# Altium schematic sheet connectors.SchDoc
size 431 x 279 mm; SheetNumber: 1; SheetTotal: 1
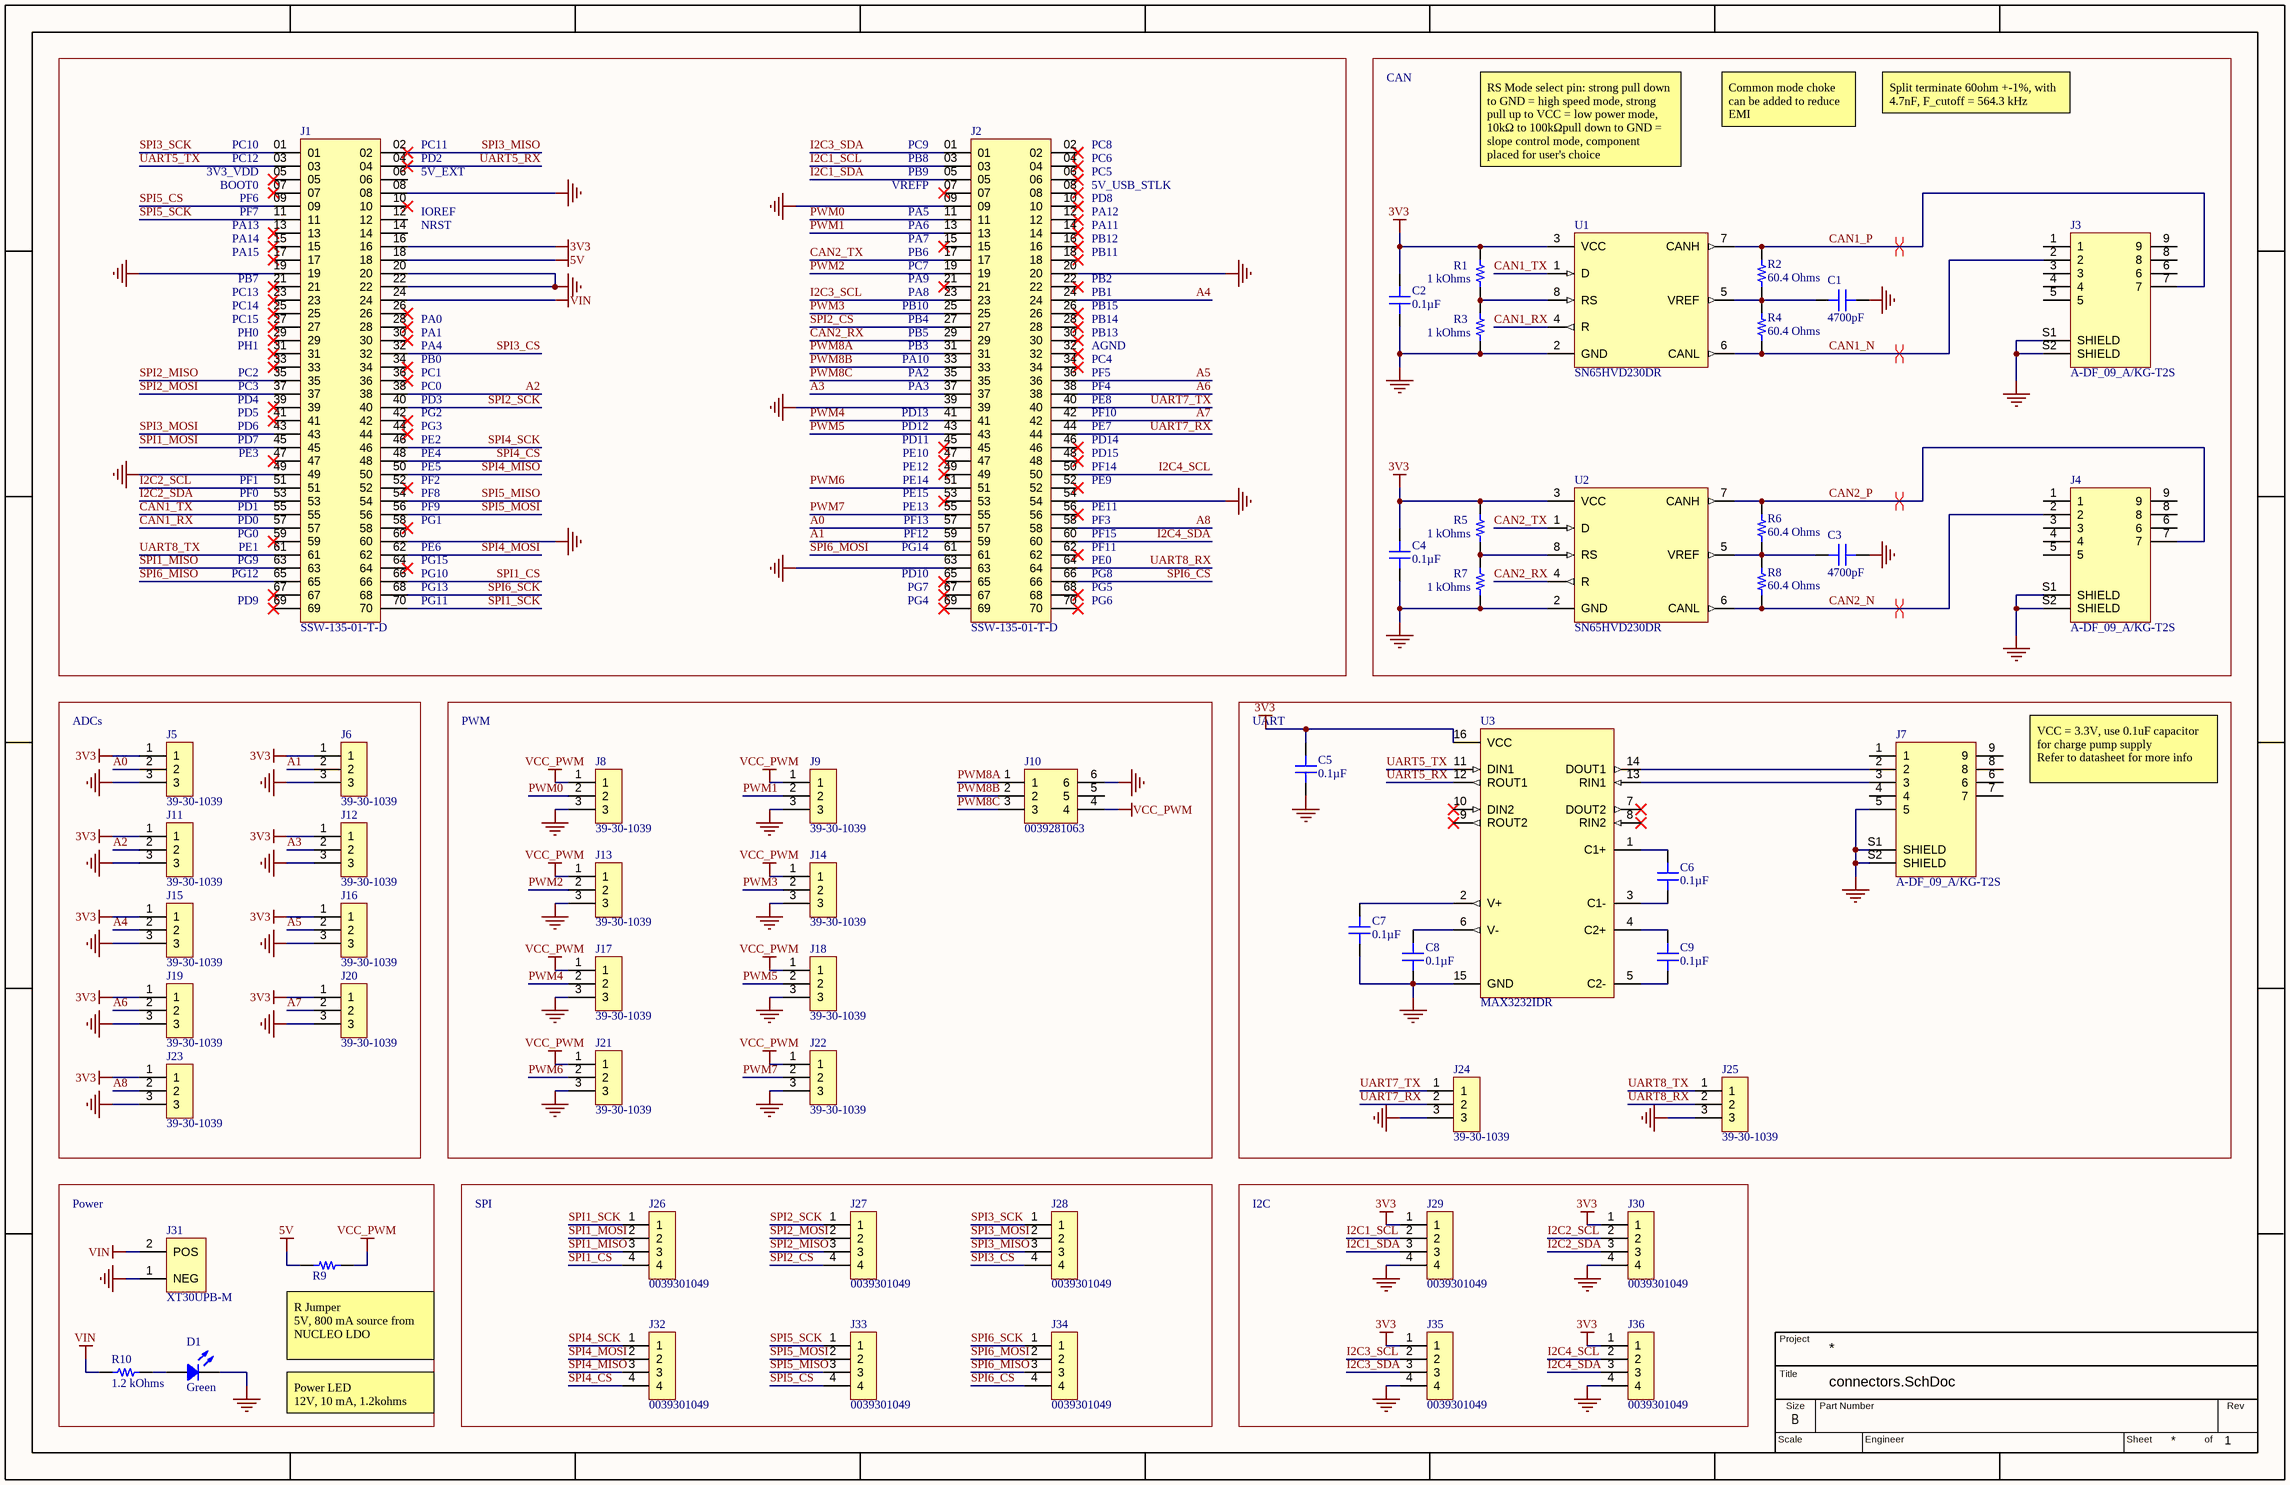
[diagram p0: connectors.SchDoc]

## Parts
C1  4700pF  [CAP 0603_1608]
C2  0.1µF  [CAP 0603_1608]
C3  4700pF  [CAP 0603_1608]
C4  0.1µF  [CAP 0603_1608]
C5  0.1µF  [CAP 0603_1608]
C6  0.1µF  [CAP 0603_1608]
C7  0.1µF  [CAP 0603_1608]
C8  0.1µF  [CAP 0603_1608]
C9  0.1µF  [CAP 0603_1608]
D1  Green  [LED 0805_2012 GREEN]
J1  SSW-135-01-T-D  [SAMTEC_SSW-135-01-T-D]
J2  SSW-135-01-T-D  [SAMTEC_SSW-135-01-T-D]
J3  A-DF_09_A/KG-T2S  [ASSMANN_A-DF09A/KG-T2S]
J4  A-DF_09_A/KG-T2S  [ASSMANN_A-DF09A/KG-T2S]
J5  39-30-1039  [MOLEX_39-30-1039]
J6  39-30-1039  [MOLEX_39-30-1039]
J7  A-DF_09_A/KG-T2S  [ASSMANN_A-DF09A/KG-T2S]
J8  39-30-1039  [MOLEX_39-30-1039]
J9  39-30-1039  [MOLEX_39-30-1039]
J10  0039281063  [MOLEX_0039281063]
J11  39-30-1039  [MOLEX_39-30-1039]
J12  39-30-1039  [MOLEX_39-30-1039]
J13  39-30-1039  [MOLEX_39-30-1039]
J14  39-30-1039  [MOLEX_39-30-1039]
J15  39-30-1039  [MOLEX_39-30-1039]
J16  39-30-1039  [MOLEX_39-30-1039]
J17  39-30-1039  [MOLEX_39-30-1039]
J18  39-30-1039  [MOLEX_39-30-1039]
J19  39-30-1039  [MOLEX_39-30-1039]
J20  39-30-1039  [MOLEX_39-30-1039]
J21  39-30-1039  [MOLEX_39-30-1039]
J22  39-30-1039  [MOLEX_39-30-1039]
J23  39-30-1039  [MOLEX_39-30-1039]
J24  39-30-1039  [MOLEX_39-30-1039]
J25  39-30-1039  [MOLEX_39-30-1039]
J26  0039301049  [MOLEX_0039301049]
J27  0039301049  [MOLEX_0039301049]
J28  0039301049  [MOLEX_0039301049]
J29  0039301049  [MOLEX_0039301049]
J30  0039301049  [MOLEX_0039301049]
J31  XT30UPB-M  [AMASS_XT30-M]
J32  0039301049  [MOLEX_0039301049]
J33  0039301049  [MOLEX_0039301049]
J34  0039301049  [MOLEX_0039301049]
J35  0039301049  [MOLEX_0039301049]
J36  0039301049  [MOLEX_0039301049]
R1  1 kOhms  [RES 0805_2012]
R2  60.4 Ohms  [RES 0603_1608]
R3  1 kOhms  [RES 0805_2012]
R4  60.4 Ohms  [RES 0603_1608]
R5  1 kOhms  [RES 0805_2012]
R6  60.4 Ohms  [RES 0603_1608]
R7  1 kOhms  [RES 0805_2012]
R8  60.4 Ohms  [RES 0603_1608]
R9  (no value)  [RES 0603_1608]
R10  1.2 kOhms  [RES 0603_1608]
U1  SN65HVD230DR  [SOIC127P599X175-8N]
U2  SN65HVD230DR  [SOIC127P599X175-8N]
U3  MAX3232IDR  [SOIC127P600X175-16N]

## Blocks framed on the sheet
CAN: C1-C4 J3 J4 R1-R8 U1 U2
ADCs: J5 J6 J11 J12 J15 J16 J19 J20 J23
PWM: J8-J10 J13 J14 J17 J18 J21 J22
UART: C5-C9 J7 J24 J25 U3
Power: D1 J31 R9 R10
SPI: J26-J28 J32-J34
I2C: J29 J30 J35 J36

## Nets
3V3: C2.2 C4.2 C5.2 J1.16 J5.1 J6.1 J11.1 J12.1 J15.1 J16.1 J19.1 J20.1 J23.1 J29.1 J30.1 J35.1 J36.1 R1.2 R5.2 U1.3(VCC) U2.3(VCC) U3.16(VCC)
5V: J1.18 R9.1
GND: C1.2 C2.1 C3.2 C4.1 C5.1 C7.1 C8.1 D1.2 J1.08 J1.19 J1.20 J1.22 J1.49 J1.60 J2.09 J2.20 J2.39 J2.54 J2.63 J3.S1(SHIELD) J3.S2(SHIELD) J4.S1(SHIELD) J4.S2(SHIELD) J5.3 J6.3 J7.5 J7.S1(SHIELD) J7.S2(SHIELD) J8.3 J9.3 J10.6 J11.3 J12.3 J13.3 J14.3 J15.3 J16.3 J17.3 J18.3 J19.3 J20.3 J21.3 J22.3 J23.3 J24.3 J25.3 J29.4 J30.4 J31.1(NEG) J35.4 J36.4 R3.1 R7.1 U1.2(GND) U2.2(GND) U3.15(GND)
VCC_PWM: J8.1 J9.1 J10.4 J13.1 J14.1 J17.1 J18.1 J21.1 J22.1 R9.2
VIN: J1.24 J31.2(POS) R10.1
A0: J2.57 J5.2
A1: J2.59 J6.2
A2: J1.38 J11.2
A3: J2.37 J12.2
A4: J2.24 J15.2
A5: J2.36 J16.2
A6: J2.38 J19.2
A7: J2.42 J20.2
A8: J2.58 J23.2
CAN1_N: J3.2 R4.2 U1.6(CANL)
CAN1_P: J3.7 R2.1 U1.7(CANH)
CAN1_RX: J1.57 U1.4(R)
CAN1_TX: J1.55 U1.1(D)
CAN2_N: J4.2 R8.2 U2.6(CANL)
CAN2_P: J4.7 R6.1 U2.7(CANH)
CAN2_RX: J2.29 U2.4(R)
CAN2_TX: J2.17 U2.1(D)
I2C1_SCL: J2.03 J29.2
I2C1_SDA: J2.05 J29.3
I2C2_SCL: J1.51 J30.2
I2C2_SDA: J1.53 J30.3
I2C3_SCL: J2.23 J35.2
I2C3_SDA: J2.01 J35.3
I2C4_SCL: J2.50 J36.2
I2C4_SDA: J2.60 J36.3
PWM0: J2.11 J8.2
PWM1: J2.13 J9.2
PWM2: J2.19 J13.2
PWM3: J2.25 J14.2
PWM4: J2.41 J17.2
PWM5: J2.43 J18.2
PWM6: J2.51 J21.2
PWM7: J2.55 J22.2
PWM8A: J2.31 J10.1
PWM8B: J2.33 J10.2
PWM8C: J2.35 J10.3
SPI1_CS: J1.66 J26.4
SPI1_MISO: J1.63 J26.3
SPI1_MOSI: J1.45 J26.2
SPI1_SCK: J1.70 J26.1
SPI2_CS: J2.27 J27.4
SPI2_MISO: J1.35 J27.3
SPI2_MOSI: J1.37 J27.2
SPI2_SCK: J1.40 J27.1
SPI3_CS: J1.32 J28.4
SPI3_MISO: J1.02 J28.3
SPI3_MOSI: J1.43 J28.2
SPI3_SCK: J1.01 J28.1
SPI4_CS: J1.48 J32.4
SPI4_MISO: J1.50 J32.3
SPI4_MOSI: J1.62 J32.2
SPI4_SCK: J1.46 J32.1
SPI5_CS: J1.09 J33.4
SPI5_MISO: J1.54 J33.3
SPI5_MOSI: J1.56 J33.2
SPI5_SCK: J1.11 J33.1
SPI6_CS: J2.66 J34.4
SPI6_MISO: J1.65 J34.3
SPI6_MOSI: J2.61 J34.2
SPI6_SCK: J1.68 J34.1
UART5_RX: J1.04 U3.12(ROUT1)
UART5_TX: J1.03 U3.11(DIN1)
UART7_RX: J2.44 J24.2
UART7_TX: J2.40 J24.1
UART8_RX: J2.64 J25.2
UART8_TX: J1.61 J25.1
NetC1_1: C1.1 R2.2 R4.1 U1.5(VREF)
NetC3_1: C3.1 R6.2 R8.1 U2.5(VREF)
NetC6_1: C6.1 U3.3(C1-)
NetC6_2: C6.2 U3.1(C1+)
NetC7_2: C7.2 U3.2(V+)
NetC8_2: C8.2 U3.6(V-)
NetC9_1: C9.1 U3.5(C2-)
NetC9_2: C9.2 U3.4(C2+)
NetD1_1: D1.1 R10.2
NetJ7_2: J7.2 U3.14(DOUT1)
NetJ7_3: J7.3 U3.13(RIN1)
NetR1_1: R1.1 R3.2 U1.8(RS)
NetR5_1: R5.1 R7.2 U2.8(RS)

Not connected (* = marked no-connect by the designer): J1 05* 06 07* 10* 12 13* 14 15* 17* 21* 23* 25* 26* 27* 28* 29* 30* 31* 33* 34* 36* 39* 41* 42* 44* 47* 52* 58* 59* 64* 67* 69*; J2 02* 04* 06* 07* 08* 10* 12* 14* 15* 16* 18* 21* 22* 26* 28* 30* 32* 34* 45* 46* 47* 48* 49* 52* 53* 56* 62* 65* 67* 68* 69* 70*; J3 1 3 4 5 6 8 9; J4 1 3 4 5 6 8 9; J7 1 4 6 7 8 9; J10 5; U3 7(DOUT2)* 8(RIN2)* 9(ROUT2)* 10(DIN2)*

## Layout directives
differential pair: CAN1_N, CAN1_P, CAN2_N, CAN2_P

## Notes on the sheet
- (near J1) PC12
- (near J1) PC10
- (near J1) PD2
- (near J1) PC11
- (near J2) PC9
- (near J2) PB8
- (near J2) PC8
- (near J2) PC6
- RS Mode select pin: strong pull down to GND = high speed mode, strong
  pull up to VCC = low power mode, 10kΩ to 100kΩpull down to GND = slope control mode, component placed for user's choice
- Common mode choke can be added to reduce EMI
- Split terminate 60ohm +-1%, with 4.7nF, F_cutoff = 564.3 kHz
- (near J1) BOOT0
- (near J1) PF6
- (near J1) PF7
- (near J1) PA13
- (near J1) 3V3_VDD
- (near J1) 5V_EXT
- (near J1) IOREF
- (near J1) NRST
- (near J2) PA5
- (near J2) PA6
- (near J2) PB9
- (near J2) VREFP
- (near J2) PC5
- (near J2) PD8
- (near J2) PA12
- (near J2) PA11
- (near J2) 5V_USB_STLK
- (near J1) PB7
- (near J1) PA15
- (near J1) PA14
- (near J1) PC13
- (near J2) PC7
- (near J2) PA8
- (near J2) PB6
- (near J2) PA7
- (near J2) PA9
- (near J2) PB1
- (near J2) PB12
- (near J2) PB11
- (near J2) PB2
- (near J1) PC14
- (near J1) PC15
- (near J1) PH0
- (near J1) PH1
- (near J1) PA0
- (near J1) PA1
- (near J1) PA4
- (near J1) PB0
- (near J2) PB10
- (near J2) PB3
- (near J2) PA10
- (near J2) PB4
- (near J2) PB5
- (near J2) PB15
- (near J2) PB14
- (near J2) PB13
- (near J2) PC4
- (near J2) AGND
- (near J1) PC3
- (near J1) PC2
- (near J1) PD6
- (near J1) PD4
- (near J1) PD5
- (near J1) PC0
- (near J1) PD3
- (near J1) PC1
- (near J1) PG2
- (near J1) PG3
- (near J2) PA2
- (near J2) PA3
- (near J2) PD13
- (near J2) PD12
- (near J2) PF5
- (near J2) PF10
- (near J2) PF4
- (near J2) PE8
- (near J2) PE7
- (near J1) PD7
- (near J1) PF1
- (near J1) PF0
- (near J1) PE3
- (near J1) PF8
- (near J1) PE2
- (near J1) PE4
- (near J1) PE5
- (near J1) PF2
- (near J2) PD11
- (near J2) PE10
- (near J2) PE12
- (near J2) PE14
- (near J2) PE15
- (near J2) PF14
- (near J2) PD14
- (near J2) PD15
- (near J2) PE9
- (near J1) PD0
- (near J1) PD1
- (near J1) PE1
- (near J1) PG9
- (near J1) PG0
- (near J1) PF9
- (near J1) PE6
- (near J1) PG1
- (near J1) PG15
- (near J2) PG14
- (near J2) PF13
- (near J2) PF12
- (near J2) PE13
- (near J2) PF3
- (near J2) PE0
- (near J2) PF15
- (near J2) PE11
- (near J2) PF11
- (near J1) PG12
- (near J1) PD9
- (near J1) PG13
- (near J1) PG10
- (near J1) PG11
- (near J2) PD10
- (near J2) PG7
- (near J2) PG4
- (near J2) PG8
- (near J2) PG5
- (near J2) PG6
- VCC = 3.3V, use 0.1uF capacitor for charge pump supply
  Refer to datasheet for more info
- (near R9) R Jumper
  5V, 800 mA source from NUCLEO LDO
- Power LED
  12V, 10 mA, 1.2kohms
- Title
- Project
- Scale
- Size
- B
- Part Number
- Engineer
- Sheet
- of
- Rev

## Library data of the parts
C1 C3 = CGA3E2X7R1H472K080AA: CAP CER 4700PF 50V X7R 0603; Manufacturer: TDK Corporation; Tolerance: ±10%; Part Number: CGA3E2X7R1H472K080AA; Value: 4700pF; Applications: Automotive; Capacitance: 4700pF; ComponentLink1Description: Datasheet; ComponentLink1URL: https://product.tdk.com/info/en/catalog/datasheets/mlcc_automotive_general_en.pdf?ref_disty=digikey; ComponentLink2Description: DigiKey Link; ComponentLink2URL: http://digikey.com/product-detail/en/tdk-corporation/CGA3E2X7R1H472K080AA/445-5661-1-ND/2443701; Device Package: 0603 (1608 Metric); LastUpdated: 9/2/2020 1:03:30 AM; Lifecycle Status: Active; Minimum Order: 1; Mounting Type: Surface Mount, MLCC; Operating Temperature: -55°C ~ 125°C; Package / Case: 0603 (1608 Metric); Packaging: TapeAndReel; PartId: 5842; Part Status: Active; Price: 0.01; Ratings: AEC-Q200; Series: CGA; Size / Dimension: 0.063" L x 0.031" W (1.60mm x 0.80mm); Supplier 1: DigiKey; Supplier Part Number 1: 445-5661-1-ND; Temperature Coefficient: X7R; Thickness (Max): 0.035" (0.90mm); Voltage - Rated: 50V
C2 C4-C9 = CL10B104KA8NNNC: CAP CER 0.1UF 25V X7R 0603; Manufacturer: Samsung Electro-Mechanics; Tolerance: ±10%; Part Number: CL10B104KA8NNNC; Value: 0.1µF; Applications: General Purpose; Capacitance: 0.1µF; ComponentLink1Description: Datasheet; ComponentLink1URL: http://www.samsungsem.com/kr/support/product-search/mlcc/CL10B104KA8NNNC.jsp; ComponentLink2Description: DigiKey Link; ComponentLink2URL: http://digikey.com/product-detail/en/samsung-electro-mechanics/CL10B104KA8NNNC/1276-1006-1-ND/3889092; Device Package: 0603 (1608 Metric); LastUpdated: 9/2/2020 1:03:22 AM; Lifecycle Status: Active; Minimum Order: 1; Mounting Type: Surface Mount, MLCC; Operating Temperature: -55°C ~ 125°C; Package / Case: 0603 (1608 Metric); Packaging: TapeAndReel; PartId: 9793; Part Status: Active; Price: 0.01; Series: CL; Size / Dimension: 0.063" L x 0.031" W (1.60mm x 0.80mm); Supplier 1: DigiKey; Supplier Part Number 1: 1276-1006-1-ND; Temperature Coefficient: X7R; Thickness (Max): 0.035" (0.90mm); Voltage - Rated: 25V
D1 = LTST-C170GKT: LED GREEN CLEAR SMD; Manufacturer: Lite-On Inc.; Configuration: Standard; Current - Test: 10mA; Lens Color: Colorless; Lens Size: 1.40mm x 1.25mm; Lens Style: Rectangle with Flat Top; Millicandela Rating: 6mcd; Viewing Angle: 130°; Voltage - Forward (Vf) (Typ): 2.1V; Wavelength - Dominant: 569nm; Wavelength - Peak: 565nm; Part Number: LTST-C170GKT; Color: Green; ComponentLink1Description: Datasheet; ComponentLink1URL: //media.digikey.com/pdf/Data%20Sheets/Lite-On%20PDFs/LTST-C170GKT.pdf; ComponentLink2Description: DigiKey Link; ComponentLink2URL: http://digikey.com/product-detail/en/lite-on-inc/LTST-C170GKT/160-1179-1-ND/269251; Device Package: 0805 (2012 Metric); Height (Max): 1.10mm; LastUpdated: 9/2/2020 1:21:04 AM; Lens Transparency: Clear; Lifecycle Status: Active; Minimum Order: 1; Mounting Type: Surface Mount; Package / Case: 0805 (2012 Metric); Packaging: TapeAndReel; PartId: 282; Part Status: Active; Price: 0.05; Series: -; Size / Dimension: 2.00mm L x 1.25mm W; Supplier 1: DigiKey; Supplier Part Number 1: 160-1179-1-ND; Value: Green
J1 J2 = SSW-135-01-T-D: MF: Samtec; Value: *; Price: None; Package: None; Availability: Unavailable; MP: SSW-135-01-T-D
J3 J4 J7 = A-DF_09_A/KG-T2S: 9 Position D-Sub Receptacle, Female Sockets Connector; MP: A-DF 09 A/KG-T2S; MF: Assmann WSW; SnapEDA_Link: https://www.snapeda.com/parts/A-DF%2009%20A/KG-T2S/Assmann%20WSW%20Components/view-part/2761262/?ref=snap; Availability: Unavailable; Check_prices: https://www.snapeda.com/parts/A-DF%2009%20A/KG-T2S/Assmann%20WSW%20Components/view-part/2761262/?ref=eda; Price: None; Value: *; Package: None
J5 J6 J8 J9 J11-J25 = 39-30-1039: Connector Header Through Hole 3 position 0.165 _4.20mm_; MP: 39301039; MF: Molex; Price: None; Value: *; Package: None; SnapEDA_Link: https://www.snapeda.com/parts/39301039/Molex/view-part/1160208/?ref=snap; Availability: Unavailable
J10 = 0039281063: Connector Header Through Hole, 6 position 0.165 (4.20mm); MP: 0026013115; MF: Molex; Package: None; DigiKey-Purchase-URL: https://snapeda.com/shop?store=DigiKey&id=2597941; Value: *; SnapEDA_Link: https://www.snapeda.com/parts/0026013115/Molex/view-part/2597941/?ref=snap; Price: None; Availability: Unavailable
J26-J30 J32-J36 = 0039301049: Connector Header Through Hole 4 position 0.165 _4.20mm_; MF: Molex; Value: *; Package: None; Price: None; SnapEDA_Link: https://www.snapeda.com/parts/0039301049/Molex/view-part/104320/?ref=snap; Availability: Unavailable; MP: 0039301049
J31 = XT30UPB-M: Plug; DC supply; XT60; male; PIN: 2; for cable; soldered; 30A; 500V; MP: XT60-M; MF: AMASS; Price: None; Package: Package Analog Devices; Value: *; Availability: Unavailable; SnapEDA_Link: https://www.snapeda.com/parts/XT60-M/AMASS/view-part/2883912/?ref=snap
R1 R3 R5 R7 = RNCP0805FTD1K00: RES 1K OHM 1% 1/4W 0805; Manufacturer: Stackpole Electronics Inc; Power (Watts): 0.25W, 1/4W; Temperature Coefficient: ±100ppm/°C; Part Number: RNCP0805FTD1K00; Value: 1 kOhms; ComponentLink1Description: Datasheet; ComponentLink1URL: https://www.seielect.com/catalog/sei-rncp.pdf; ComponentLink2Description: DigiKey Link; ComponentLink2URL: http://digikey.com/product-detail/en/stackpole-electronics-inc/RNCP0805FTD1K00/RNCP0805FTD1K00CT-ND/2240568; Composition: Thin Film; Device Package: 0805 (2012 Metric); Features: Anti-Sulfur, Moisture Resistant; Height - Seated (Max): 0.024" (0.60mm); LastUpdated: 9/2/2020 1:15:23 AM; Lifecycle Status: Active; Minimum Order: 1; Number of Terminations: 2; Operating Temperature: -55°C ~ 155°C; Package / Case: 0805 (2012 Metric); Packaging: TapeAndReel; PartId: 28023; Part Status: Active; Price: 0.01; Resistance: 1 kOhms; Series: RNCP; Size / Dimension: 0.079" L x 0.049" W (2.00mm x 1.25mm); Supplier 1: DigiKey; Supplier Part Number 1: RNCP0805FTD1K00CT-ND; Supplier Device Package: 0805; Tolerance: ±1%
R2 R4 R6 R8 = RMCF0603FT60R4: RES 60.4 OHM 1% 1/10W 0603; Manufacturer: Stackpole Electronics Inc; Power (Watts): 0.1W, 1/10W; Temperature Coefficient: ±100ppm/°C; Part Number: RMCF0603FT60R4; Value: 60.4 Ohms; ComponentLink1Description: Datasheet; ComponentLink1URL: https://www.seielect.com/catalog/sei-rmcf_rmcp.pdf; ComponentLink2Description: DigiKey Link; ComponentLink2URL: http://digikey.com/product-detail/en/stackpole-electronics-inc/RMCF0603FT60R4/RMCF0603FT60R4CT-ND/2418105; Composition: Thick Film; Device Package: 0603 (1608 Metric); Features: Automotive AEC-Q200; Height - Seated (Max): 0.022" (0.55mm); LastUpdated: 9/2/2020 1:10:13 AM; Lifecycle Status: Active; Minimum Order: 1; Number of Terminations: 2; Operating Temperature: -55°C ~ 155°C; Package / Case: 0603 (1608 Metric); Packaging: CutTape; PartId: 10803; Part Status: Active; Price: 0.10; Ratings: AEC-Q200; Resistance: 60.4 Ohms; Series: RMCF; Size / Dimension: 0.061" L x 0.031" W (1.55mm x 0.80mm); Supplier 1: DigiKey; Supplier Part Number 1: RMCF0603FT60R4CT-ND; Supplier Device Package: 0603; Tolerance: ±1%
R9 = CRCW06030000Z0EBC: RES SMD 0 OHM JUMP 1/10W 0603; Manufacturer: Vishay Dale; Power (Watts): 0.1W, 1/10W; Tolerance: Jumper; Part Number: CRCW06030000Z0EBC; ComponentLink1Description: Datasheet; ComponentLink1URL: http://www.vishay.com/docs/28773/crcwce3.pdf; ComponentLink2Description: DigiKey Link; ComponentLink2URL: http://digikey.com/product-detail/en/vishay-dale/CRCW06030000Z0EBC/541-4013-1-ND/7928696; Composition: Thick Film; Device Package: 0603 (1608 Metric); Height - Seated (Max): 0.022" (0.55mm); LastUpdated: 9/2/2020 1:10:22 AM; Lifecycle Status: Active; Minimum Order: 1; Number of Terminations: 2; Operating Temperature: -55°C ~ 155°C; Package / Case: 0603 (1608 Metric); Packaging: CutTape; PartId: 6257; Part Status: Active; Price: 0.10; Series: CRCW-C; Supplier 1: DigiKey; Supplier Part Number 1: 541-4013-1-ND; Supplier Device Package: 0603
R10 = CRGCQ0603F1K2: CRGCQ 0603 1K2 1%; Manufacturer: TE Connectivity Passive Product; Power (Watts): 0.1W, 1/10W; Temperature Coefficient: ±100ppm/°C; Part Number: CRGCQ0603F1K2; Value: 1.2 kOhms; ComponentLink1Description: Datasheet; ComponentLink1URL: https://www.te.com/commerce/DocumentDelivery/DDEController?Action=srchrtrv&DocNm=1773204-3&DocType=DS&DocLang=English; ComponentLink2Description: DigiKey Link; ComponentLink2URL: http://digikey.com/product-detail/en/te-connectivity-passive-product/CRGCQ0603F1K2/A129689CT-ND/8577521; Composition: Thick Film; Device Package: 0603 (1608 Metric); Features: Automotive AEC-Q200, Moisture Resistant; Height - Seated (Max): 0.022" (0.55mm); LastUpdated: 9/2/2020 1:09:39 AM; Lifecycle Status: Active; Minimum Order: 1; Number of Terminations: 2; Operating Temperature: -55°C ~ 155°C; Package / Case: 0603 (1608 Metric); Packaging: CutTape; PartId: 23998; Part Status: Active; Price: 0.10; Ratings: AEC-Q200; Resistance: 1.2 kOhms; Series: CRGCQ; Size / Dimension: 0.063" L x 0.031" W (1.60mm x 0.80mm); Supplier 1: DigiKey; Supplier Part Number 1: A129689CT-ND; Supplier Device Package: 0603; Tolerance: ±1%
U1 U2 = SN65HVD230DR: 3.3 V CAN Transceiver with Standby Mode 8-SOIC -40 to 85; MF: Texas Instruments; Package: SOIC-8 Texas Instruments; DigiKey-Purchase-URL: https://snapeda.com/shop?store=DigiKey&id=51767; MP: SN65HVD230DR; Mouser-Purchase-URL: https://snapeda.com/shop?store=Mouser&id=51767; Value: *; Arrow_Electronics-Purchase-URL: https://snapeda.com/shop?store=Arrow+Electronics&id=51767; Availability: Good; SnapEDA_Link: https://www.snapeda.com/parts/SN65HVD230DR/Texas%20Instruments/view-part/51767/?ref=snap; Price: None; Texas_Instruments-Purchase-URL: https://snapeda.com/shop?store=Texas+Instruments&id=51767
U3 = MAX3232IDR: 3-V to 5.5-V multichannel RS-232 line driver & receiver 16-SOIC -40 to 85; MF: Texas Instruments; Check_prices: https://www.snapeda.com/parts/MAX3232IDR/Texas%20Instruments/view-part/559735/?ref=eda; Value: *; Package: SOIC-16 Texas Instruments; MP: MAX3232IDR; Purchase-URL: https://pricing.snapeda.com/search/part/MAX3232IDR/?ref=eda; SnapEDA_Link: https://www.snapeda.com/parts/MAX3232IDR/Texas%20Instruments/view-part/559735/?ref=snap; Digi-Key_Part_Number: 296-13098-1-ND